# Altium project curret_sensor.PrjPcb
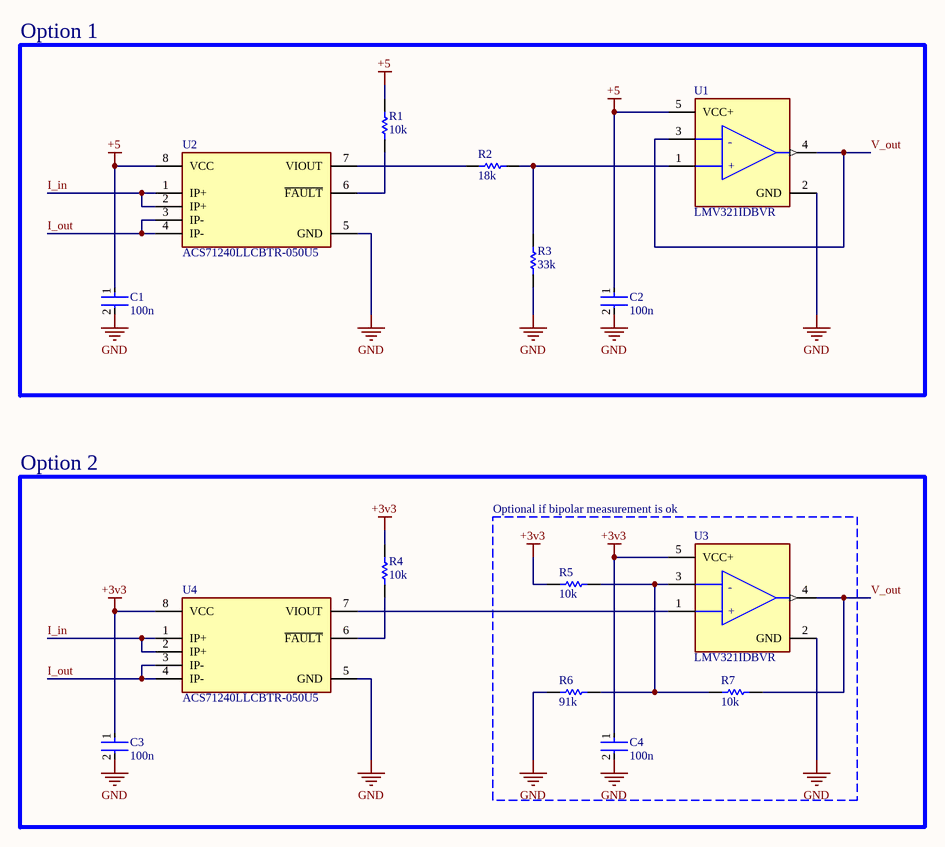
[diagram p0: Sheet1.SchDoc]
1 sheet, 15 parts. Net scope: global (net labels, ports and power ports of the same name join across sheets).

## Sheet Sheet1.SchDoc: Current sensor
size A4; SheetNumber: 1; SheetTotal: 1

### Parts
C1  100n  [FP-0402B104K500CT-IPC_C]
C2  100n  [FP-0402B104K500CT-IPC_C]
C3  100n  [FP-0402B104K500CT-IPC_C]
C4  100n  [FP-0402B104K500CT-IPC_C]
R1  10k  [RESC1609X50X30NL8T20]
R2  18k  [RESC1609X50X30NL8T20]
R3  33k  [RESC1609X50X30NL8T20]
R4  10k  [RESC1609X50X30NL8T20]
R5  10k  [RESC1609X50X30NL8T20]
R6  91k  [RESC1609X50X30NL8T20]
R7  10k  [RESC1609X50X30NL8T20]
U1  LMV321IDBVR  [FP-DBV0005A-MFG]
U2  ACS71240LLCBTR-050U5  [FP-LCB-8-MFG]
U3  LMV321IDBVR  [FP-DBV0005A-MFG]
U4  ACS71240LLCBTR-050U5  [FP-LCB-8-MFG]

### Blocks framed on the sheet
Option 1: C1 C2 R1-R3 U1 U2
Option 2: C3 R4 U4
Optional if bipolar measurement is ok: C4 R5-R7 U3

### Nets
+3v3: C3.1 C4.1 R4.2 R5.2 U3.5(VCC+) U4.8(VCC)
+5: C1.1 C2.1 R1.2 U1.5(VCC+) U2.8(VCC)
GND: C1.2 C2.2 C3.2 C4.2 R3.1 R6.2 U1.2(GND) U2.5(GND) U3.2(GND) U4.5(GND)
I_in: U2.1(IP+) U2.2(IP+) U4.1(IP+) U4.2(IP+)
I_out: U2.3(IP-) U2.4(IP-) U4.3(IP-) U4.4(IP-)
V_out: R7.1 U1.3(1IN-) U1.4(OUT) U3.4(OUT)
NetR1_1: R1.1 U2.6(~{FAULT})
NetR2_1: R2.1 R3.2 U1.1(1IN+)
NetR2_2: R2.2 U2.7(VIOUT)
NetR4_1: R4.1 U4.6(~{FAULT})
NetR5_1: R5.1 R6.1 R7.2 U3.3(1IN-)
NetU3_1: U3.1(1IN+) U4.7(VIOUT)

### Notes on the sheet
- (in symbol CMP-04895-000056-1) -; +

### Library data of the parts
C1-C4 = CMP-45632-000010-1: CAP CER 0.1UF 50V X7R 0402; Tolerance: 10%; Capacitance: 100nF; Max Operating Temperature: 125°C; Case Code (Metric): 1005; RoHS Compliant: Yes; Series: -; Case Code (Imperial): 0402; Voltage Rating: 50V; Min Operating Temperature: -55°C; Mount: Surface Mount; Case/Package: 0402; Packaging: Cut Tape
R1-R7 = CMP-1666-00005-4: Chip Resistor, 10 KOhm, +/- 1%, 100 mW, -55 to 155 degC, 0603 (1608 Metric), RoHS, Tape and Reel; Manufacturer: Vishay Semiconductor; Voltage Rating: 75 V; Max Operating Temperature: 155 degC; PackageDescription: 2-Pin Surface Mount Device, Body 1.575 x 0.85 mm; ComponentLink1Description: Manufacturer URL; RoHSCompliant: true; PackageReference: 0603; REACH SVHC: Unknown; Length: 1.55 mm; DatasheetVersion: 06/2012; Packaging: Tape and Reel; Min Operating Temperature: -55 degC; Mounting Technology: Surface Mount; ComponentLink2URL: https://datasheet.ciiva.com/11809/0900766b80d98afc-11809037.pdf; Height: 0.45 mm; ComponentLink2Description: Datasheet; Package Quantity: 5000; ComponentLink1URL: http://www.vishay.com/
U1 U3 = CMP-04895-000056-1: IC OPAMP GP 1 CIRCUIT SOT23-5; Manufacturer: Texas Instruments; Bandwidth: 1MHz; Number Of Channels: 1; Max Junction Temp: +150°C; Input Offset Voltage: 1.7mV; Standoff Height: 0mm; Voltage Gain: 100V/mV; Min Supply Voltage: 2.7V; Input Bias Current: 0.015uA; Nominal Supply Current: 80-130uA; Max Supply Voltage: 5.5V; Ambient Temperature Range Low: -40°C; Device Class L3: Amplifiers - Op Amps; Package: DBV0005A; Temperature: -40°C to +125°C; Automotive: No; Ambient Temperature Range High: +125°C; ComponentLink2Description: Datasheet; Manufacturer Part Number: LMV321IDBVR; Octopart: https://octopart.com/lmv321idbvr-texas+instruments-410381; ComponentLink2URL: http://www.ti.com/lit/ds/symlink/lmv321.pdf; Temperature Range High: +125°C; Device Class L1: Integrated Circuits (ICs); Temperature Range Low: -40°C; Digikey Description: IC OPAMP GP 1 CIRCUIT SOT23-5; RoHS: TRUE; Height: 1.45mm; Mouser Description: Operational Amplifiers - Op Amps Low V R/R; Device Class L2: Linear ICs; Gain Bandwidth: 1MHz; Lead Free: Yes; Category: IC
U2 U4 = CMP-82923-000089-1: AUTOMOTIVE-GRADE, GALVANICALLY I